# EAGLE design loaddump (EAGLE 6.1)
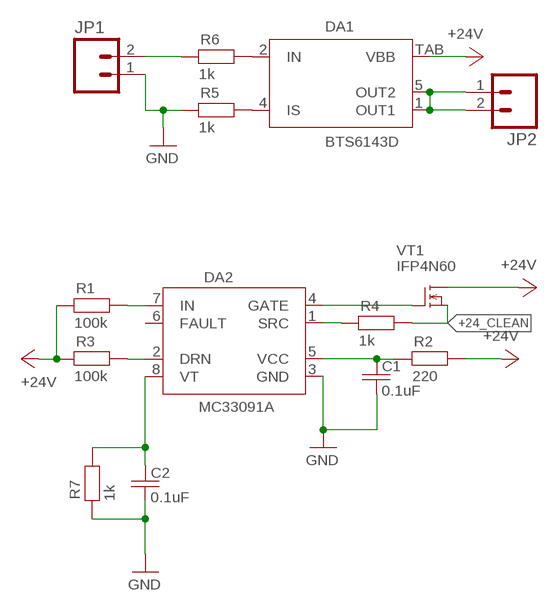
[diagram p0: schematic, sheet 1]

## Parts
C1  0.1uF  C-EUC0805  [C0805]
C2  0.1uF  C-EUC0805  [C0805]
DA1  BTS6143D  [TO252-5-11]
DA2  MC33091A  [SO08]
JP1  M02PTH3  [1X02_LONGPADS]
JP2  M02PTH3  [1X02_LONGPADS]
R1  100k  R-EU_R0805  [R0805]
R2  220  R-EU_0922/22  [0922/22]
R3  100k  R-EU_R0805  [R0805]
R4  1k  R-EU_R0805  [R0805]
R5  1k  R-EU_R0805  [R0805]
R6  1k  R-EU_R0805  [R0805]
R7  1k  R-EU_R0805  [R0805]
VT1  IFP4N60  [TO220]

## Nets
+24_CLEAN: R4.2 VT1.3(S)
+24V: DA1.TAB(VBB) R1.1 R2.2 R3.1 VT1.2(D)
GND: C1.2 C2.2 DA2.3(GND) JP1.1 R5.1 R7.1
N$1: DA2.7(IN) R1.2
N$2: DA2.4(GATE) VT1.1(G)
N$3: C1.1 DA2.5(VCC) R2.1
N$4: DA2.2(DRN) R3.2
N$5: DA2.1(SRC) R4.1
N$7: DA1.1(OUT1) DA1.5(OUT2) JP2.1 JP2.2
N$8: DA1.4(IS) R5.2
N$9: DA1.2(IN) R6.2
N$10: JP1.2 R6.1
N$11: C2.1 DA2.8(VT) R7.2
Unconnected: DA2.6(FAULT)

## Library data of the parts
C1 C2 = rcl:C-EU: CAPACITOR, European symbol
DA1 = transistor-fet:BTS
DA2 = driver-fet:MC33091A
JP1 JP2 = SparkFun:M02: Header 2 Standard 2-pin 0.1" header. Use with straight break away headers (SKU : PRT-00116), right angle break away headers (PRT-00553), swiss pins (PRT-00743), machine pins (PRT-00117), and female headers (PRT-00115). Molex polarized connector foot print use with SKU : PRT-08233 with associated crimp pins and housings.
R1-R7 = rcl:R-EU_: RESISTOR, European symbol
VT1 = transistor-fet:IFP4N60: N-Channel Enhancement MOSFET

## Board
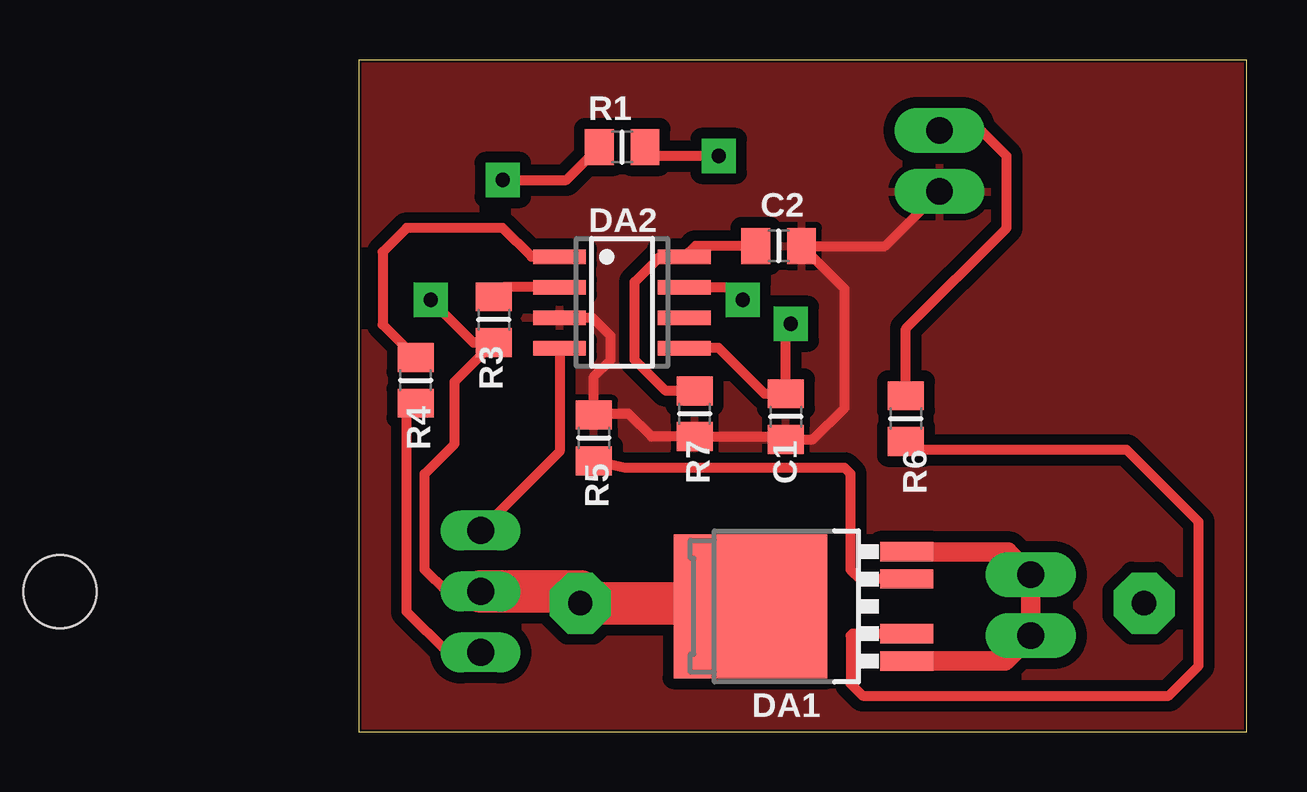
[diagram p1: board, top side]
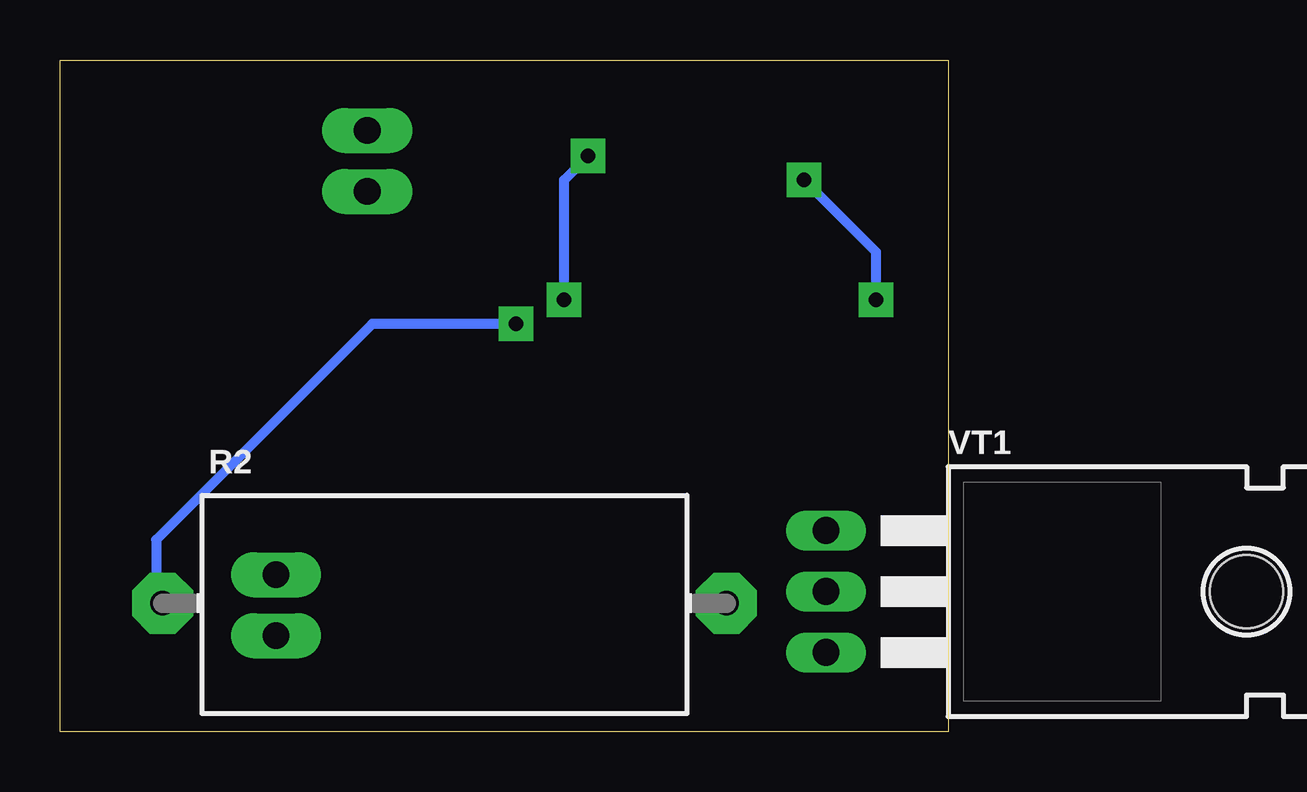
[diagram p2: board, bottom side, seen from below]

Size 37 x 28 mm. Coordinates in mm from the lower left corner, seen from the top.
Outline: 37,0 37,28 0,28 0,0 37,0
Copper layers (1*16): Top 0.035mm / dielectric 1.5mm / Bottom 0.035mm
Design rules: minimum track width 10mil, minimum drill 24mil, track to track 18mil, track to pad 18mil, pad to pad 18mil, via to via 18mil, smd to smd 18mil, copper to edge 4mil, drill to drill 8mil, minimum pad ring 10mil, minimum via ring 8mil, stop-mask expansion 4mil, vias tented up to drill 0mil, thermal gap 10mil

### Footprints (pad centres in the part's own frame; a part is rotated, then mirrored left to right if it is on the bottom)
C0805 = smd 1.2 x 1.5: 1 -0.953,0; 2 0.953,0
TO252-5-11 = smd 0.8 x 2.2: 1 -2.28,-5.01; 2 -1.14,-5.01; 4 1.14,-5.01; 5 2.28,-5.01 | smd 6 x 6.4: TAB 0,1.5
SO08 = smd 0.6 x 2.2: 1 -1.905,-2.6; 2 -0.635,-2.6; 3 0.635,-2.6; 4 1.905,-2.6; 5 1.905,2.6; 6 0.635,2.6; 7 -0.635,2.6; 8 -1.905,2.6
1X02_LONGPADS = drill 1.118 pad 1.88 long: 1 0,0; 2 2.54,0
R0805 = smd 1.2 x 1.5: 1 -0.953,0; 2 0.953,0
0922/22 = drill 1.016 pad 2.54 octagon: 1 -11.748,0; 2 11.748,0
TO220 = drill 1.118 long: 1 -2.54,-6.35; 2 0,-6.35; 3 2.54,-6.35 | hole 3.048: 0,11.176

### Placement (x,y rotation side)
C1  17.8,13.13 270 top
C2  17.5,20.25 0 top
DA1  17.82,5.22 90 top
DA2  10.97,17.89 270 top
JP1  24.2,22.52 90 top
JP2  28,4 90 top
R1  10.98,24.37 0 top
R2  20.98,5.35 0 bottom
R3  5.63,17.17 90 top
R4  2.37,14.64 270 top
R5  9.8,12.24 270 top
R6  22.8,13.05 270 top
R7  14,13.25 90 top
VT1  -1.27,5.84 270 bottom

### Tracks (layer width: path | path; a pad name or v marks a point on that pad's centre or on a via)
+24_CLEAN
  Top 0.406: VT1.3 3.7,3.3 2,5 2,13.32 R4.2
+24V  (via drill 0.6 pad 1.42)
  Top 0.406: VT1.2 3.66,5.84 2.75,6.75 2.75,10.75 4,12 4,14.59 R3.1 4.78,16.22 v3,18 | v6,23 8.66,23 R1.1
  Top 1.778: VT1.2 9.23,5.84 R2.2 18,5.35 18,5 16.32,5 DA1.TAB
  Bottom 0.406: v3,18 3,20 v6,23
GND
  Top 0.406: DA2.3 9.75,17.25 10.5,16.5 10.5,15.5 9.8,14.8 R5.1 9.86,13.25 11.25,13.25 12.2,12.3 R7.1 17.68,12.3 C1.2 18.93,12.18 20.25,13.5 20.25,18.45 C2.2 21.93,20.25 JP1.1
  pour Top: 0,28 37,28 37,0 0,0
N$1  (via drill 0.6 pad 1.42)
  Top 0.406: DA2.7 15.47,18.52 v16,18 | v15,24 12.3,24 R1.2
  Bottom 0.406: v16,18 16,23 v15,24
N$2
  Top 0.406: DA2.4 8.37,11.67 VT1.1
N$3  (via drill 0.6 pad 1.42)
  Top 0.406: DA2.5 13.59,16 15,16 16.92,14.08 C1.1 17.8,16.8 v18,17
  Bottom 0.406: v18,17 24,17 33,8 33,5.62 R2.1
N$4
  Top 0.406: DA2.2 6.03,18.52 R3.2
N$5
  Top 0.406: DA2.1 7.21,19.8 6,21 2,21 1,20 1,16.96 R4.1
N$7
  Top 0.813: DA1.5 27.04,7.5 JP2.2 JP2.1 26.94,2.94 DA1.1
N$8
  Top 0.406: DA1.4 20.89,6.36 20.5,6.75 20.5,10.75 20.25,11 11.09,11 R5.2
N$9
  Top 0.406: DA1.2 20.58,4.08 20.5,4 20.5,2 21,1.5 33.75,1.5 35,2.75 35,8.75 32,11.75 23.15,11.75 R6.2
N$10
  Top 0.406: R6.1 22.8,16.8 27,21 27,24 26,25 24.26,25 JP1.2
N$11
  Top 0.406: R7.2 12.8,14.2 11.5,15.5 11.5,18.75 12.5,19.75 13.53,19.75 DA2.8 14.03,20.25 C2.1